# EAGLE design laser zender (EAGLE 9.3.2)
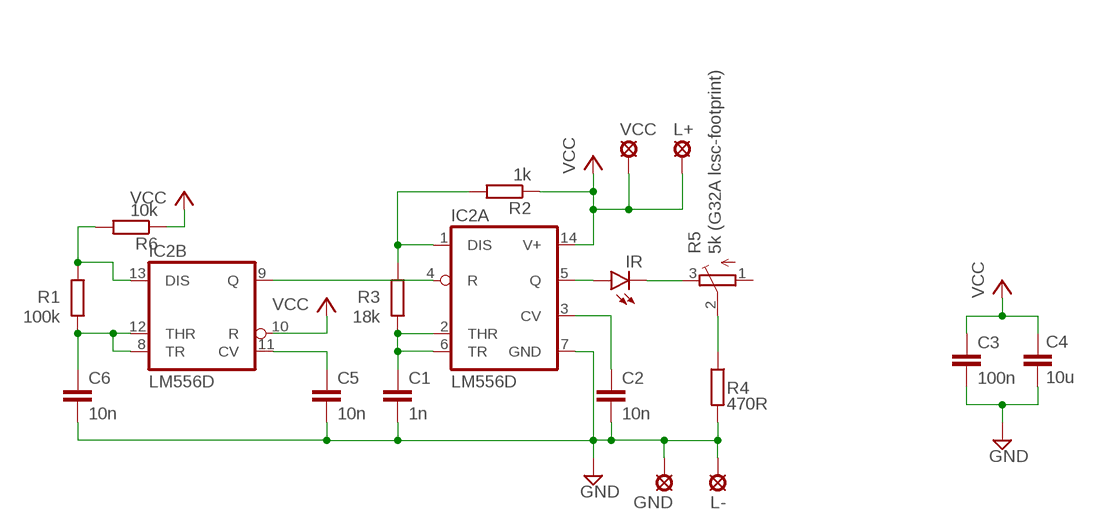
[diagram p0: schematic, sheet 1]

## Parts
C1  1n  C-EUC0805  [C0805]
C2  10n  C-EUC0805  [C0805]
C3  100n  C-EUC0805  [C0805]
C4  10u  C-EUC0805  [C0805]
C5  10n  C-EUC0805  [C0805]
C6  10n  C-EUC0805  [C0805]
GND  LSP10  [LSP10]
IC2  LM556D  [SO14]
IR  LEDCHIPLED_0805  [CHIPLED_0805]
L+  LSP10  [LSP10]
L-  LSP10  [LSP10]
R1  100k  R-EU_R0805  [R0805]
R2  1k  R-EU_R0805  [R0805]
R3  18k  R-EU_R0805  [R0805]
R4  470R  R-EU_R0805  [R0805]
R5  5k (G32A lcsc-footprint)  TRIM_EU-3223W  [3223W]
R6  10k  R-EU_R0805  [R0805]
VCC  LSP10  [LSP10]

## Nets
GND: C1.2 C2.2 C3.2 C4.2 C5.2 C6.2 GND.MP IC2.7(A:GND) L-.MP R4.2
N$1: IR.C R5.3(E)
N$2: C2.1 IC2.3(A:CV)
N$3: C1.1 IC2.2(A:THR) IC2.6(A:TR) R3.1
N$4: R4.1 R5.2(S)
N$5: IC2.1(A:DIS) R2.2 R3.2
N$6: IC2.5(A:Q) IR.A
N$7: IC2.4(A:R) IC2.9(B:Q)
N$8: IC2.13(B:DIS) R1.2 R6.2
N$9: C5.1 IC2.11(B:CV)
N$10: C6.1 IC2.8(B:TR) IC2.12(B:THR) R1.1
VCC: C3.1 C4.1 IC2.10(B:R) IC2.14(A:V+) L+.MP R2.1 R6.1 VCC.MP
Unconnected: R5.1(A)

## Library data of the parts
C1-C6 = rcl:C-EU: CAPACITOR, European symbol; SPICEPREFIX: C
GND L+ L- VCC = solpad:LSP10: SOLDER PAD drill 1.0 mm, distributor Buerklin, 12H555
IC2 = linear edited:*556: Dual TIMER
IR = led:LED: LED OSRAM: - CHIPLED LG R971, LG N971, LY N971, LG Q971, LY Q971, LO R971, LY R971 LH N974, LH R974 LS Q976, LO Q976, LY Q976 LO Q996 - Hyper CHIPLED LW Q18S LB Q993, LB Q99A, LB R99A - SideLED LS A670, LO A670, LY A670, LG A670, LP A670 LB A673, LV A673, LT A673, LW A673 LH A674 LY A675 LS A676, LA A676, LO A676, LY A676, LW A676 LS A679, LY A679, LG A679 - Hyper Micro SIDELED® LS Y876, LA Y876, LO Y876, LY Y876 LT Y87S - SmartLED LW L88C, LW L88S LB L89C, LB L89S, LG L890 LS L89K, LO L89K, LY L89K LS L896, LA L896, LO L896, LY L896 - TOPLED LS T670, LO T670, LY T670, LG T670, LP T670 LSG T670, LSP T670, LSY T670, LOP T670, LYG T670 LG T671, LOG T671, LSG T671 LB T673, LV T673, LT T673, LW T673 LH T674 LS T676, LA T676, LO T676, LY T676, LB T676, LH T676, LSB T676, LW T676 LB T67C, LV T67C, LT T67C, LS T67K, LO T67K, LY T67K, LW E67C LS E67B, LA E67B, LO E67B, LY E67B, LB E67C, LV E67C, LT E67C LW T67C LS T679, LY T679, LG T679 LS T770, LO T770, LY T770, LG T770, LP T770 LB T773, LV T773, LT T773, LW T773 LH T774 LS E675, LA E675, LY E675, LS T675 LS T776, LA T776, LO T776, LY T776, LB T776 LHGB T686 LT T68C, LB T68C - Hyper Mini TOPLED® LB M676 - Mini TOPLED Santana® LG M470 LS M47K, LO M47K, LY M47K Source: http://www.osram.convergy.de LUXEON: - LUMILED® LXK2-PW12-R00, LXK2-PW12-S00, LXK2-PW14-U00, LXK2-PW14-V00 LXK2-PM12-R00, LXK2-PM12-S00, LXK2-PM14-U00 LXK2-PE12-Q00, LXK2-PE12-R00, LXK2-PE12-S00, LXK2-PE14-T00, LXK2-PE14-U00 LXK2-PB12-K00, LXK2-PB12-L00, LXK2-PB12-M00, LXK2-PB14-N00, LXK2-PB14-P00, LXK2-PB14-Q00 LXK2-PR12-L00, LXK2-PR12-M00, LXK2-PR14-Q00, LXK2-PR14-R00 LXK2-PD12-Q00, LXK2-PD12-R00, LXK2-PD12-S00 LXK2-PH12-R00, LXK2-PH12-S00 LXK2-PL12-P00, LXK2-PL12-Q00, LXK2-PL12-R00 Source: www.luxeon.com KINGBRIGHT: KA-3528ASYC Source: www.kingbright.com
R1-R4 R6 = rcl:R-EU_: RESISTOR, European symbol; SPICEPREFIX: R
R5 = pot:TRIM_EU-: POTENTIOMETER

## Board
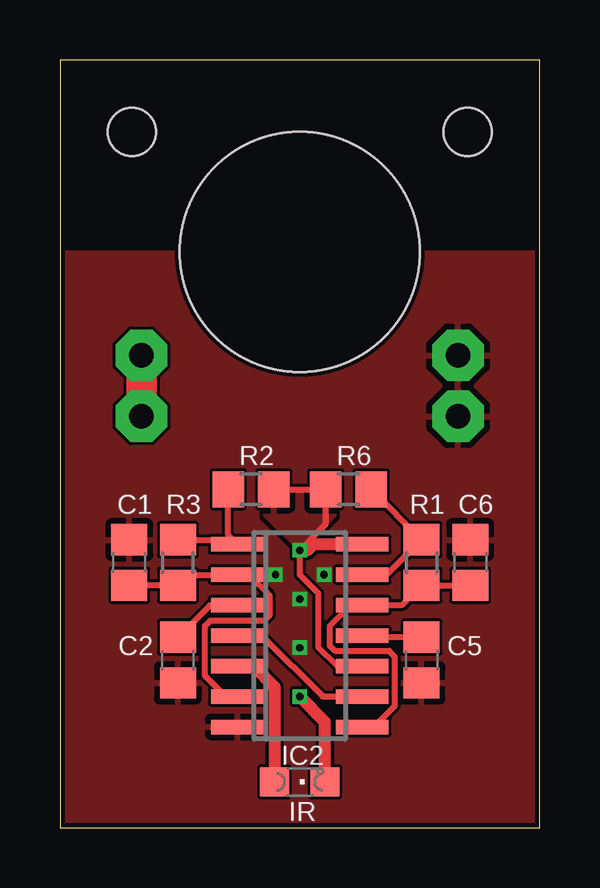
[diagram p1: board, top side]
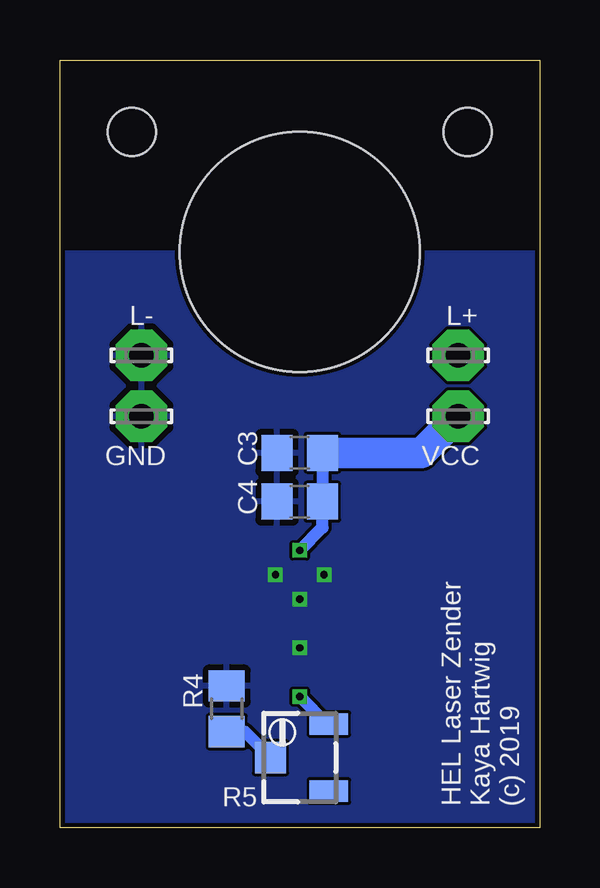
[diagram p2: board, bottom side, seen from below]

Size 20 x 32 mm. Coordinates in mm from the lower left corner, seen from the top.
Outline: 0,0 20,0 20,32 0,32 0,0
Copper layers (1*16): Top 0.035mm / dielectric 1.5mm / Bottom 0.035mm
Design rules "default": minimum track width 5mil, minimum drill 0.3mm, track to track 5mil, track to pad 5mil, pad to pad 5mil, via to via 5mil, smd to smd 5mil, copper to edge 0.2mm, drill to drill 6mil, minimum pad ring 10mil, minimum via ring 0.15mm, stop-mask expansion 4mil, vias tented up to drill 0mil, thermal gap 10mil
Holes 10 mm at 10,24
Holes 2 mm at 17,29 3,29

### Footprints (pad centres in the part's own frame; a part is rotated, then mirrored left to right if it is on the bottom)
C0805 = smd 1.3 x 1.5: 1 -0.95,0; 2 0.95,0
LSP10 = drill 1.016 pad 2.159 octagon: MP 0,0
SO14 = smd 0.6 x 2.2: 1 -3.81,-2.6; 2 -2.54,-2.6; 3 -1.27,-2.6; 4 0,-2.6; 5 1.27,-2.6; 6 2.54,-2.6; 7 3.81,-2.6; 8 3.81,2.6; 9 2.54,2.6; 10 1.27,2.6; 11 0,2.6; 12 -1.27,2.6; 13 -2.54,2.6; 14 -3.81,2.6
CHIPLED_0805 = smd 1.2 x 1.2: A 0,-1.05; C 0,1.05
R0805 = smd 1.3 x 1.5: 1 -0.95,0; 2 0.95,0
3223W = smd 0.9 x 1.6: 1 -1.4,-1.215; 3 1.4,-1.215 | smd 1.3 x 1.3: 2 0,1.215

### Placement (x,y rotation side)
C1  2.89,11.05 90 top
C2  4.92,6.98 270 top
C3  10,15.62 180 bottom
C4  10,13.59 180 bottom
C5  15.08,6.98 270 top
C6  17.11,11.05 90 top
GND  16.6,17.14 180 bottom
IC2  10,8 270 top
IR  10,1.9 270 top
L+  3.4,19.68 0 bottom
L-  16.6,19.68 0 bottom
R1  15.08,11.05 90 top
R2  7.97,14.1 180 top
R3  4.92,11.05 90 top
R4  13.05,4.95 90 bottom
R5  10,2.92 90 bottom
R6  12.03,14.1 0 top
VCC  3.4,17.14 180 bottom

### Tracks (layer width: path | path; a pad name or v marks a point on that pad's centre or on a via)
GND  (via drill 0.3)
  other vias: 8.98,10.54 11.02,10.54 10,9.52 10,7.49
  pour Top (rank 2): -2,24 22,24 22,-1 -2,-1
  pour Bottom: -3,24 23,24 23,-2 -3,-2
N$1  (via drill 0.3)
  Top 0.508: IR.C 11.05,4.41 v10,5.46
  Bottom 0.508: R5.3 8.86,4.32 v10,5.46
N$2
  Top 0.254: C2.1 6.26,9.27 IC2.3
N$3
  Top 0.254: C1.1 R3.1 5.36,10.54 IC2.2 7.89,10.54 8.75,9.68 8.75,8.87 8.52,8.63 6.28,8.63 6.05,8.4 6.05,6.33 6.91,5.46 IC2.6
N$4
  Bottom 0.508: R4.1 12.3,4 R5.2
N$5
  Top 0.254: R3.2 7.21,12 IC2.1 7.02,12.19 R2.2
N$6
  Top 0.508: IC2.5 8.07,6.73 8.95,5.85 IR.A
N$7
  Top 0.254: IC2.4 8.42,8 10.96,5.46 IC2.9
N$8
  Top 0.254: IC2.13 13.62,10.54 R1.2 R6.2
N$9
  Top 0.254: C5.1 12.67,7.93 IC2.11
N$10
  Top 0.254: C6.1 R1.1 14.25,9.27 IC2.12 12.11,9.27 11.25,8.4 11.25,7.59 11.48,7.37 13.72,7.37 13.95,7.13 13.95,5.05 13.09,4.19 IC2.8
VCC  (via drill 0.3)
  Top 0.254: IC2.10 11.57,6.73 10.76,7.54 10.76,9.78 10,10.54 v10,11.56 11.08,12.64 R6.1 R2.1
  Top 0.508: IC2.14 10.57,11.81 10.31,11.56 v10,11.56
  Top 1.27: VCC.MP L+.MP
  Bottom 0.508: C3.1 C4.1 9.05,12.51 v10,11.56
  Bottom 1.27: C3.1 4.92,15.62 VCC.MP
  pour Top: 10,11.56 8.48,13.08 8.48,14.1 11.52,14.1 11.52,13.08

### Text on the board
bNames: HEL Laser Zender / Kaya Hartwig / (c) 2019